# Altium schematic sheet CPU.schdoc
size Tabloid
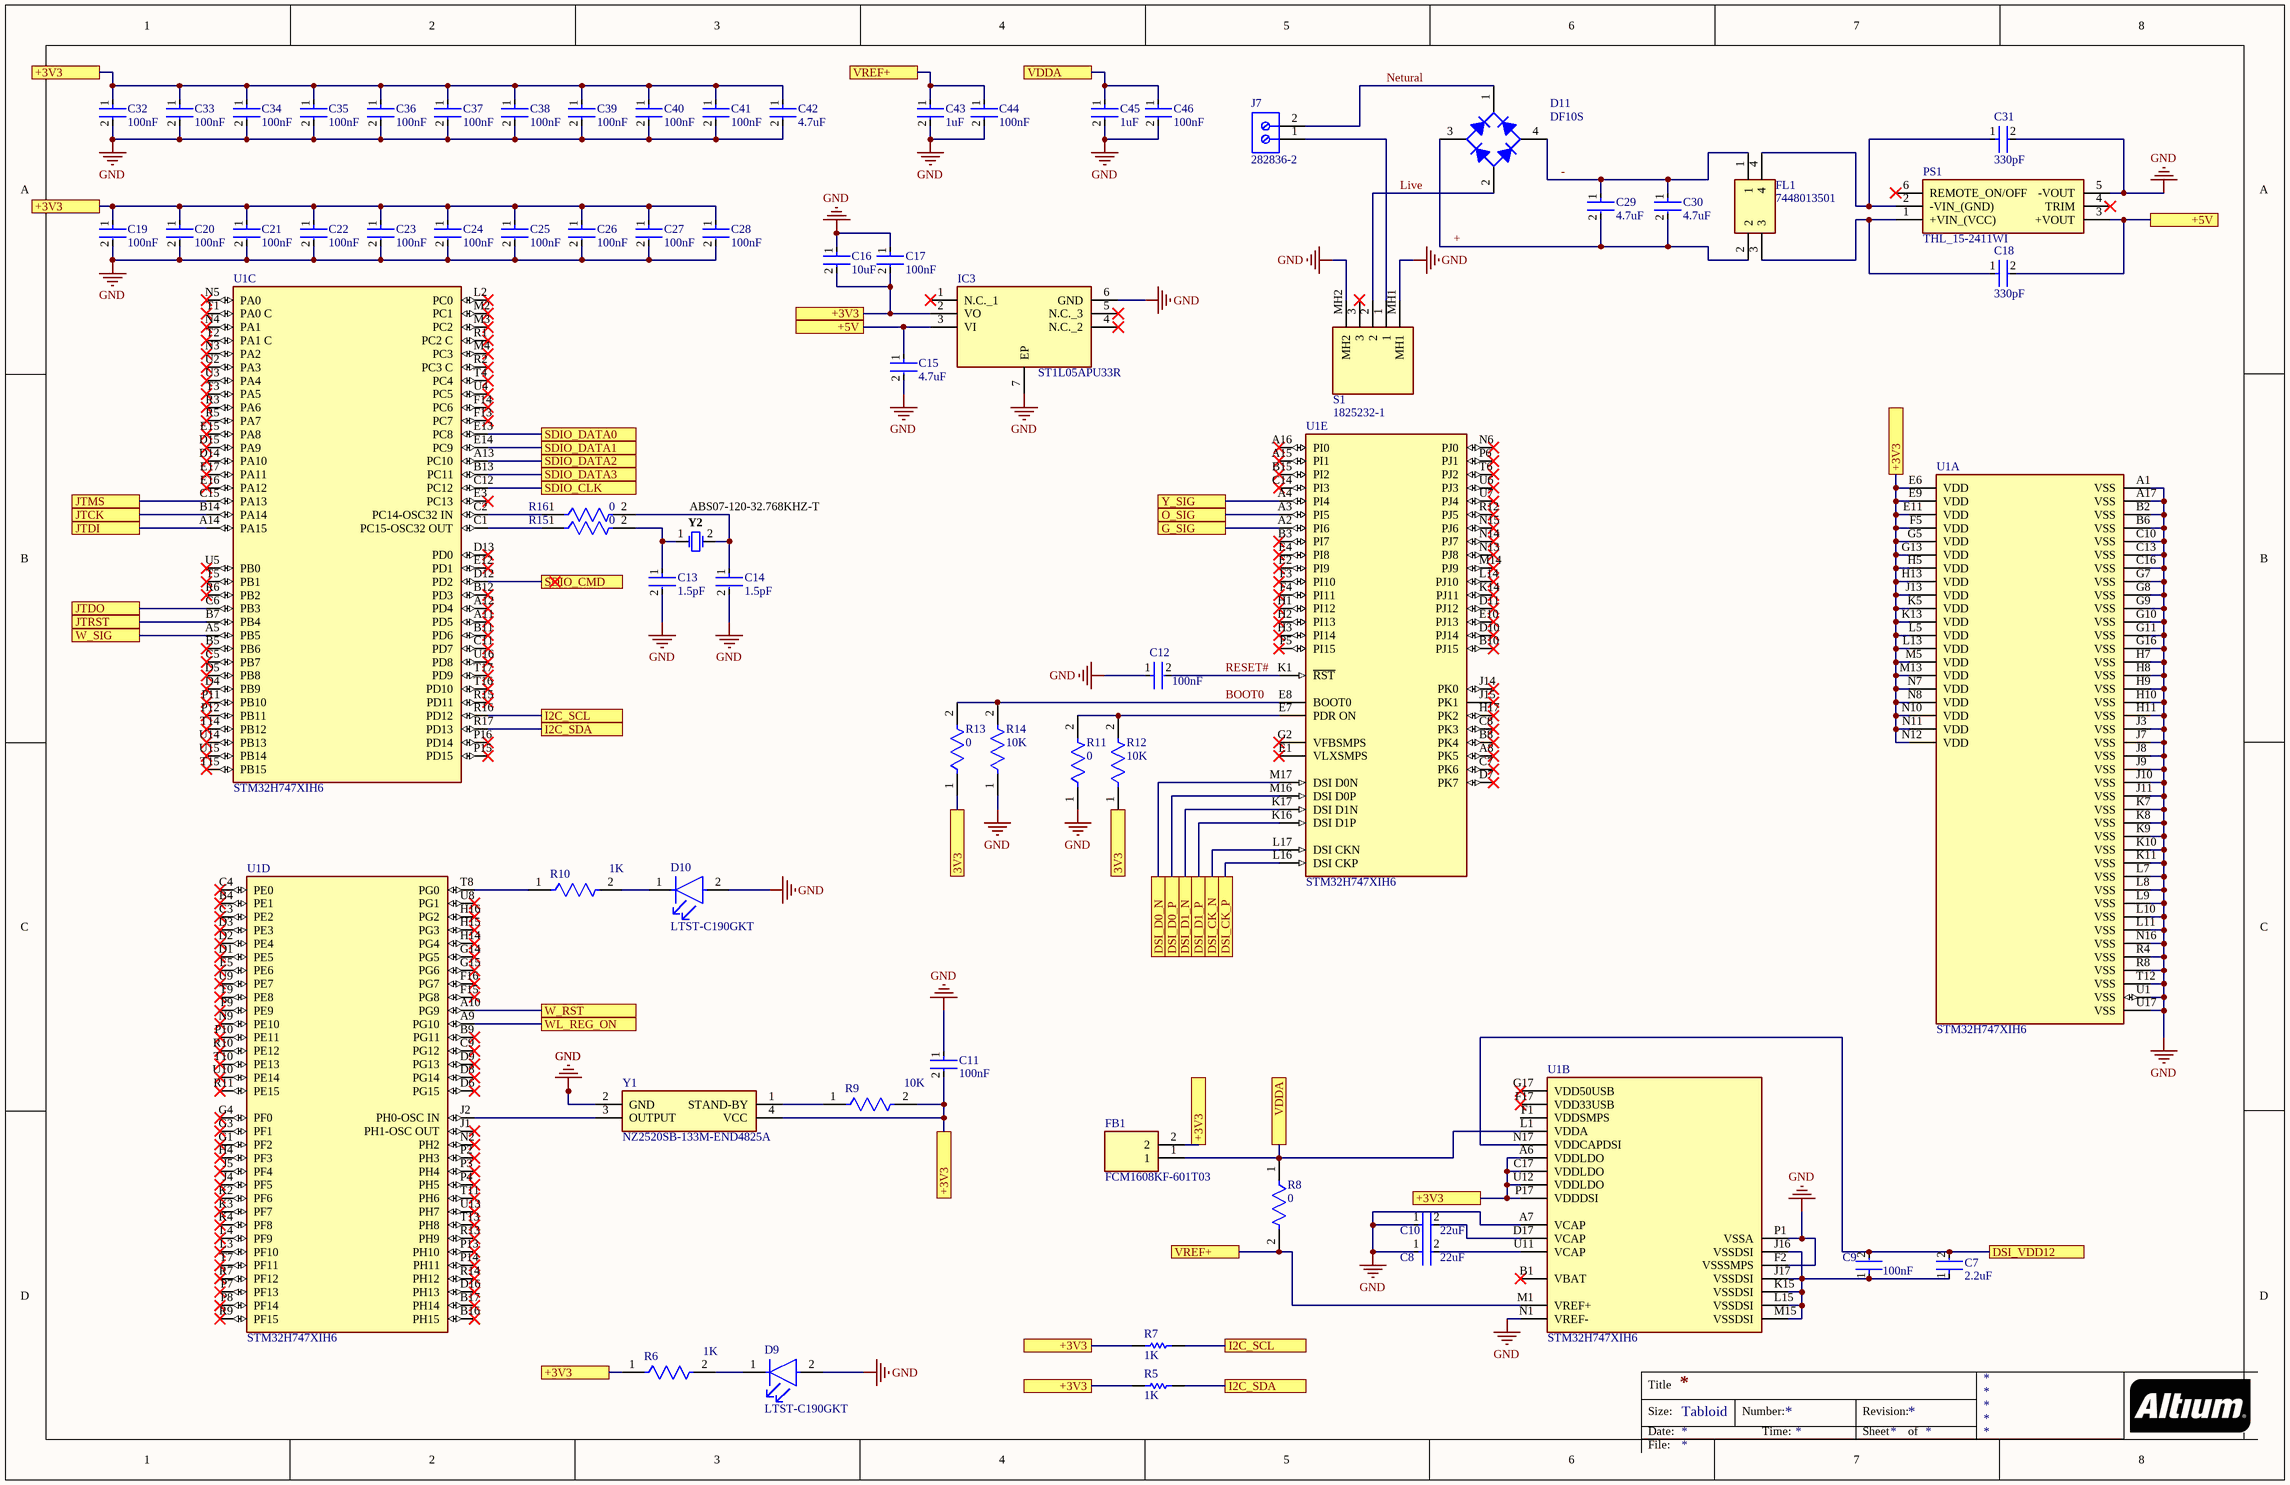
[diagram p0: CPU.schdoc]

## Parts
C7  2.2uF  [FP-GJM155-0_05-IPC_C]
C8  22uF  [FP-GJM155-0_05-IPC_C]
C9  100nF  [FP-GJM155-0_05-IPC_C]
C10  22uF  [FP-GJM155-0_05-IPC_C]
C11  100nF  [FP-GJM155-0_05-IPC_C]
C12  100nF  [FP-GJM155-0_05-IPC_C]
C13  1.5pF  [FP-GJM155-0_05-IPC_C]
C14  1.5pF  [FP-GJM155-0_05-IPC_C]
C15  4.7uF  [FP-GRM155-0_1-IPC_B]
C16  10uF  [FP-GRM188-0_1-e0_2_0_55-IPC_A]
C17  100nF  [FP-GRM033-0_03-MFG]
C18  330pF  [FP-GRM155-0_05-MFG]
C19  100nF  [FP-GRM033-0_03-MFG]
C20  100nF  [FP-GRM033-0_03-MFG]
C21  100nF  [FP-GRM033-0_03-MFG]
C22  100nF  [FP-GRM033-0_03-MFG]
C23  100nF  [FP-GRM033-0_03-MFG]
C24  100nF  [FP-GRM033-0_03-MFG]
C25  100nF  [FP-GRM033-0_03-MFG]
C26  100nF  [FP-GRM033-0_03-MFG]
C27  100nF  [FP-GRM033-0_03-MFG]
C28  100nF  [FP-GRM033-0_03-MFG]
C29  4.7uF  [FP-GRM155-0_1-IPC_B]
C30  4.7uF  [FP-GRM155-0_1-IPC_B]
C31  330pF  [FP-GRM155-0_05-MFG]
C32  100nF  [FP-GRM033-0_03-MFG]
C33  100nF  [FP-GRM033-0_03-MFG]
C34  100nF  [FP-GRM033-0_03-MFG]
C35  100nF  [FP-GRM033-0_03-MFG]
C36  100nF  [FP-GRM033-0_03-MFG]
C37  100nF  [FP-GRM033-0_03-MFG]
C38  100nF  [FP-GRM033-0_03-MFG]
C39  100nF  [FP-GRM033-0_03-MFG]
C40  100nF  [FP-GRM033-0_03-MFG]
C41  100nF  [FP-GRM033-0_03-MFG]
C42  4.7uF  [FP-GRM155-0_1-IPC_B]
C43  1uF  [FP-GRM15-0_1-MFG]
C44  100nF  [FP-GRM033-0_03-MFG]
C45  1uF  [FP-GRM15-0_1-MFG]
C46  100nF  [FP-GRM033-0_03-MFG]
D9  LTST-C190GKT  [FP-LTST-C190GKT-MFG]
D10  LTST-C190GKT  [FP-LTST-C190GKT-MFG]
D11  DF10S  [FAIR-SDIP-4_V]
FB1  FCM1608KF-601T03  [BEADC1608X95N]
FL1  7448013501  [7448013501]
IC3  ST1L05APU33R  [SON95P300X300X100-7N-D]
J7  282836-2  [TECO-282836-2_V]
PS1  THL_15-2411WI  [THL152411WI]
R5  1K  [RESC1608X55X30LL20T20]
R6  1K  [FP-CRCW0402-e3-MFG]
R7  1K  [RESC1608X55X30LL20T20]
R8  0  [FP-CRCW0402-e3-IPC_C]
R9  10K  [FP-CRCW0402-e3-MFG]
R10  1K  [FP-CRCW0402-e3-MFG]
R11  0  [FP-CRCW0402-e3-IPC_C]
R12  10K  [FP-CRCW0402-e3-IPC_C]
R13  0  [FP-CRCW0402-e3-IPC_C]
R14  10K  [FP-CRCW0402-e3-IPC_C]
R15  0  [FP-CRCW0402-e3-IPC_C]
R16  0  [FP-CRCW0402-e3-IPC_C]
S1  1825232-1  [18252321]
U1  STM32H747XIH6  [FP-TFBGA240+25-A07U-MFG]  (parts A,B,C,D,E of 5)
Y1  NZ2520SB-133M-END4825A  [NZ2520SD]
Y2  ABS07-120-32.768KHZ-T  [ABRA-ABS07_A_V]

## Ports
3V3, +3V3, +5V, DSI_CK_N, DSI_CK_P, DSI_D0_N, DSI_D0_P, DSI_D1_N, DSI_D1_P, DSI_VDD12, G_SIG, I2C_SCL, I2C_SDA, JTCK, JTDI, JTDO, JTMS, JTRST, O_SIG, SDIO_CLK, SDIO_CMD, SDIO_DATA0, SDIO_DATA1, SDIO_DATA2, SDIO_DATA3, VDDA, VREF+, W_RST, W_SIG, WL_REG_ON, Y_SIG

## Nets
GND: C8.1 C10.1 C11.1 C12.1 C13.2 C14.2 C15.2 C16.1 C17.1 C19.2 C20.2 C21.2 C22.2 C23.2 C24.2 C25.2 C26.2 C27.2 C28.2 C31.2 C32.2 C33.2 C34.2 C35.2 C36.2 C37.2 C38.2 C39.2 C40.2 C41.2 C42.2 C43.2 C44.2 C45.2 C46.2 D9.2(A) D10.2(A) IC3.6(GND) IC3.7(EP) PS1.5(-VOUT) R11.1 R14.1 S1.MH1 S1.MH2 U1.A1(VSS) U1.A7(VCAP) U1.A17(VSS) U1.B2(VSS) U1.B6(VSS) U1.C10(VSS) U1.C13(VSS) U1.C16(VSS) U1.F2(VSSSMPS) U1.G7(VSS) U1.G8(VSS) U1.G9(VSS) U1.G10(VSS) U1.G11(VSS) U1.G16(VSS) U1.H7(VSS) U1.H8(VSS) U1.H9(VSS) U1.H10(VSS) U1.H11(VSS) U1.J3(VSS) U1.J7(VSS) U1.J8(VSS) U1.J9(VSS) U1.J10(VSS) U1.J11(VSS) U1.K7(VSS) U1.K8(VSS) U1.K9(VSS) U1.K10(VSS) U1.K11(VSS) U1.L7(VSS) U1.L8(VSS) U1.L9(VSS) U1.L10(VSS) U1.L11(VSS) U1.N1(VREF-) U1.N16(VSS) U1.P1(VSSA) U1.R4(VSS) U1.R8(VSS) U1.T12(VSS) U1.U1(VSS) U1.U17(VSS) Y1.2(GND)
3V3: R12.1 R13.1 ; port 3V3
+: C29.2 C30.2 D11.3(C) FL1.2
+3V3: C11.2 C16.2 C17.2 C19.1 C20.1 C21.1 C22.1 C23.1 C24.1 C25.1 C26.1 C27.1 C28.1 C32.1 C33.1 C34.1 C35.1 C36.1 C37.1 C38.1 C39.1 C40.1 C41.1 C42.1 FB1.2 IC3.2(VO) R5.1 R6.1 R7.1 R9.2 U1.A6(VDDLDO) U1.C17(VDDLDO) U1.E6(VDD) U1.E9(VDD) U1.E11(VDD) U1.F5(VDD) U1.G5(VDD) U1.G13(VDD) U1.H5(VDD) U1.H13(VDD) U1.J13(VDD) U1.K5(VDD) U1.K13(VDD) U1.L5(VDD) U1.L13(VDD) U1.M5(VDD) U1.M13(VDD) U1.N7(VDD) U1.N8(VDD) U1.N10(VDD) U1.N11(VDD) U1.N12(VDD) U1.P17(VDDDSI) U1.U12(VDDLDO) Y1.4(VCC) ; port +3V3
+5V: C15.1 C18.2 IC3.3(VI) PS1.3(+VOUT) ; port +5V
-: C29.1 C30.1 D11.4(C) FL1.1
BOOT0: R13.2 R14.2 U1.E8(BOOT0)
DSI_CK_N: U1.L17(DSI_CKN) ; port DSI_CK_N
DSI_CK_P: U1.L16(DSI_CKP) ; port DSI_CK_P
DSI_D0_N: U1.M17(DSI_D0N) ; port DSI_D0_N
DSI_D0_P: U1.M16(DSI_D0P) ; port DSI_D0_P
DSI_D1_N: U1.K17(DSI_D1N) ; port DSI_D1_N
DSI_D1_P: U1.K16(DSI_D1P) ; port DSI_D1_P
DSI_VDD12: C7.2 C9.2 U1.N17(VDDCAPDSI) ; port DSI_VDD12
G_SIG: U1.A2(PI6) ; port G_SIG
I2C_SCL: R7.2 U1.R16(PD12) ; port I2C_SCL
I2C_SDA: R5.2 U1.R17(PD13) ; port I2C_SDA
JTCK: U1.B14(PA14) ; port JTCK
JTDI: U1.A14(PA15) ; port JTDI
JTDO: U1.C6(PB3) ; port JTDO
JTMS: U1.C15(PA13) ; port JTMS
JTRST: U1.B7(PB4) ; port JTRST
Live: D11.2(A) S1.2
Netural: D11.1(K) J7.2
O_SIG: U1.A3(PI5) ; port O_SIG
RESET#: C12.2 U1.K1(~{RST})
SDIO_CLK: U1.C12(PC12) ; port SDIO_CLK
SDIO_CMD: U1.D12(PD2) ; port SDIO_CMD
SDIO_DATA0: U1.E13(PC8) ; port SDIO_DATA0
SDIO_DATA1: U1.E14(PC9) ; port SDIO_DATA1
SDIO_DATA2: U1.A13(PC10) ; port SDIO_DATA2
SDIO_DATA3: U1.B13(PC11) ; port SDIO_DATA3
VDDA: C45.1 C46.1 FB1.1 R8.1 U1.L1(VDDA) ; port VDDA
VREF+: C43.1 C44.1 R8.2 U1.M1(VREF+) ; port VREF+
W_RST: U1.A10(PG9) ; port W_RST
W_SIG: U1.A5(PB5) ; port W_SIG
WL_REG_ON: U1.A9(PG10) ; port WL_REG_ON
Y_SIG: U1.A4(PI4) ; port Y_SIG
NetC7_1: C7.1 C9.1 U1.J16(VSSDSI) U1.J17(VSSDSI) U1.K15(VSSDSI) U1.L15(VSSDSI) U1.M15(VSSDSI)
NetC8_2: C8.2 U1.U11(VCAP)
NetC10_2: C10.2 U1.D17(VCAP)
NetC13_1: C13.1 R15.2 Y2.1
NetC14_1: C14.1 R16.2 Y2.2
NetC18_1: C18.1 FL1.3 PS1.1(+VIN_(VCC))
NetC31_1: C31.1 FL1.4 PS1.2(-VIN_(GND))
NetD9_1: D9.1(C) R6.2
NetD10_1: D10.1(C) R10.2
NetJ7_1: J7.1 S1.1
NetR9_1: R9.1 Y1.1(STAND-BY)
NetR10_1: R10.1 U1.T8(PG0)
NetR11_2: R11.2 R12.2 U1.E7(PDR_ON)
NetR15_1: R15.1 U1.C1(PC15-OSC32_OUT)
NetR16_1: R16.1 U1.C2(PC14-OSC32_IN)
NetU1_J2: U1.J2(PH0-OSC_IN) Y1.3(OUTPUT)

Not connected (* = marked no-connect by the designer): IC3 1(N.C._1)* 4(N.C._2)* 5(N.C._3)*; PS1 4(TRIM)* 6(REMOTE_ON/OFF)*; S1 3*; U1 A8(PK5)* A11(PD5)* A12(PD4)* A15(PI1)* A16(PI0)* B1(VBAT)* B3(PI7)* B4(PE1)* B5(PB6)* B8(PK4)* B9(PG11)* B10(PJ15)* B11(PD6)* B12(PD3)* B15(PI2)* B16(PH15)* B17(PH14)* C3(PE2)* C4(PE0)* C5(PB7)* C7(PK6)* C8(PK3)* C9(PG12)* C11(PD7)* C14(PI3)* D1(PE5)* D2(PE4)* D3(PE3)* D4(PB9)* D5(PB8)* D6(PG15)* D7(PK7)* D8(PG14)* D9(PG13)* D10(PJ14)* D11(PJ12)* D13(PD0)* D14(PA10)* D15(PA9)* D16(PH13)* E1(VLXSMPS)* E2(PI9)* E3(PC13)* E4(PI8)* E5(PE6)* E10(PJ13)* E12(PD1)* E15(PA8)* E16(PA12)* E17(PA11)* F1(VDDSMPS) F3(PI10)* F4(PI11)* F13(PC7)* F14(PC6)* F15(PG8)* F16(PG7)* F17(VDD33USB)* G1(PF2)* G2(VFBSMPS)* G3(PF1)* G4(PF0)* G14(PG5)* G15(PG6)* G17(VDD50USB)* H1(PI12)* H2(PI13)* H3(PI14)* H4(PF3)* H14(PG4)* H15(PG3)* H16(PG2)* H17(PK2)* J1(PH1-OSC_OUT)* J4(PF5)* J5(PF4)* J14(PK0)* J15(PK1)* K2(PF6)* K3(PF7)* K4(PF8)* K14(PJ11)* L2(PC0)* L3(PF10)* L4(PF9)* L14(PJ10)* M2(PC1)* M3(PC2)* M4(PC3)* M14(PJ9)* N2(PH2)* N3(PA2)* N4(PA1)* N5(PA0)* N6(PJ0)* N9(PE10)* N13(PJ8)* N14(PJ7)* N15(PJ6)* P2(PH3)* P3(PH4)* P4(PH5)* P5(PI15)* P6(PJ1)* P7(PF13)* P8(PF14)* P9(PE9)* P10(PE11)* P11(PB10)* P12(PB11)* P13(PH10)* P14(PH11)* P15(PD15)* P16(PD14)* R1(PC2_C)* R2(PC3_C)* R3(PA6)* R5(PA7)* R6(PB2)* R7(PF12)* R9(PF15)* R10(PE12)* R11(PE15)* R12(PJ5)* R13(PH9)* R14(PH12)* R15(PD11)* T1(PA0_C)* T2(PA1_C)* T3(PA5)* T4(PC4)* T5(PB1)* T6(PJ2)* T7(PF11)* T9(PE8)* T10(PE13)* T11(PH6)* T13(PH8)* T14(PB12)* T15(PB15)* T16(PD10)* T17(PD9)* U2(PA3)* U3(PA4)* U4(PC5)* U5(PB0)* U6(PJ3)* U7(PJ4)* U8(PG1)* U9(PE7)* U10(PE14)* U13(PH7)* U14(PB13)* U15(PB14)* U16(PD8)*

## Notes on the sheet
- Title
- Size:
- Date:
- Tabloid
- Number:
- Time:
- Revision:
- Sheet
- of
- File:

## Library data of the parts
C7-C14 = CMP-2008-03820-2: Multi-Layer Ceramic Capacitor 1.5pF C0G  ±0.1pF 0402 Paper T/R; Temperature Coefficient: 30ppm/°C; Voltage Rating: 50V; Depth: 0.5mm; Case Code (Imperial): 0402; Package Quantity: 10000; Length: 1mm; Number of Pins: 2; Max Operating Temperature: 125°C; Mount: Surface Mount; Construction: Flat; Thickness: 0.022inch; Series: GJM; Packaging: Tape and Reel; Radiation Hardening: No; REACH SVHC: No SVHC; Case/Package: 0402; Lead Free: Lead Free; Voltage Rating (DC): 50V; Min Operating Temperature: -55°C; Dielectric: C0G; Termination: SMD/SMT; Width: 0.5mm; Capacitance: 1.5pF; Lead Pitch: 0.3mm; Case Code (Metric): 1005; Voltage: 50V; Height: 0.5mm
C15 C29 C30 C42 = CMP-2008-04549-2: Chip Multilayer Ceramic Capacitors for General Purpose, 0402, 4.7uF, X5R, 15%, 20%, 6.3V; Height: 0.5mm; Weight: 0.000212oz; Length: 1mm; Case Code (Metric): 1005; Packaging: Tape and Reel; Termination: SMD/SMT; Dielectric: X5R; Depth: 0.5mm; Case Code (Imperial): 0402; Min Operating Temperature: -55°C; Case/Package: 0402; Voltage: 6.3V; Width: 0.02inch; Capacitance: 4.7uF; Lead Free: Lead Free; Thickness: 0.022inch; Contact Plating: Tin; REACH SVHC: No SVHC; Package Quantity: 10000; Tolerance: 20%; Voltage Rating (DC): 6.3V; Voltage Rating: 6.3V; Mount: Surface Mount; Max Operating Temperature: 85°C
C16 = CMP-2006-02792-2: Chip Multilayer Ceramic Capacitors for General Purpose, 0603, 10uF, X5R, 15%, 20%, 6.3V; Packaging: Tape and Reel; Voltage Rating (DC): 6.3V; Width: 0.031inch; Termination: SMD/SMT; Dielectric: X5R; Package Quantity: 4000; Voltage Rating: 6.3V; Capacitance: 10uF; Case/Package: 0603; Min Operating Temperature: -55°C; Voltage: 6.3V; Length: 1.6mm; Thickness: 0.035inch; Lead Free: Lead Free; Depth: 0.8mm; Case Code (Imperial): 0603; Max Operating Temperature: 85°C; Material: Ceramic; Height: 0.8mm; Tolerance: 20%; Mount: Surface Mount; REACH SVHC: No SVHC; Radiation Hardening: No; Case Code (Metric): 1608
C17 C19-C28 C32-C41 C44 C46 = CMP-06035-000062-2: Chip Multilayer Ceramic Capacitors for General Purpose, 0201, 0.10uF, X5R, 15%, 10%, 6.3V; Min Operating Temperature: -55°C; Lead Free: Lead Free; Radiation Hardening: No; Dielectric: X5R; Voltage Rating (DC): 6.3V; REACH SVHC: No SVHC; Case/Package: 0201; Voltage Rating: 6.3V; Length: 0.6mm; Max Operating Temperature: 85°C; Width: 0.012inch; Depth: 0.3mm; Material: Ceramic; Case Code (Metric): 0603; Thickness: 0.013inch; Packaging: Tape and Reel; Height: 0.3mm; Capacitance: 100nF; Weight: 6E-06oz; Package Quantity: 1; Mount: Surface Mount; Voltage: 6.3V; Case Code (Imperial): 0201; Tolerance: 10%; Termination: SMD/SMT
C18 C31 = CMP-06035-004830-1: Chip Multilayer Ceramic Capacitors for General Purpose, 0402, 330pF, C0G, 30ppm/°C, 5%, 50V; Insulation Resistance: 10GR; REACH SVHC: No SVHC; Depth: 0.5mm; Voltage Rating (DC): 50V; Number of Pins: 2; Max Operating Temperature: 125°C; Dielectric: C0G; Tolerance: 5%; Package Quantity: 1; Length: 1mm; Thickness: 0.022inch; Case/Package: 0402; Lead Free: Lead Free; Case Code (Imperial): 0402; Material: Ceramic; Voltage Rating: 50V; Voltage: 50V; Radiation Hardening: No; Min Operating Temperature: -55°C; Packaging: Tape and Reel; Capacitance: 330pF; Case Code (Metric): 1005; Width: 0.5mm; Mount: Surface Mount; Height: 0.5mm; Temperature Coefficient: 30ppm/°C; Termination: SMD/SMT
C43 C45 = CMP-2008-04556-2: CAP CER 1UF 10V X5R 0402; Manufacturer Part Number: GRM155R61A105KE15D; Manufacturer: Murata; Material: Ceramic; Tolerance: 10%; Temperature Coefficient: 15%; Octopart: https://octopart.com/grm155r61a105ke15d-murata-197442; Lead Free: Yes; ComponentLink2Description: Datasheet; Temperature: -55°C to +85°C; Temperature Range High: +85°C; Height: 0.55mm; Capacitance: 1uF; Ipc Land Pattern Name: CAPC10050X50; ComponentLink2URL: https://search.murata.co.jp/Ceramy/image/img/A01X/G101/ENG/GRM155R61A105KE15-01A.pdf; Temperature Range Low: -55°C; Device Class L2: Capacitors; Voltage Rating: 10V; RoHS: TRUE; Device Class L1: Passive Components; Device Class L3: Ceramic Capacitors; Temperature Characteristic: X5R; Mouser Description: 0402 1 uF 10 V ±10% Tolerance X5R Surface Mount Multilayer Ceramic Capacitor; Automotive: No; Package: GRM15-0.1; Digikey Description: CAP CER 1UF 10V X5R 0402; Value: 1uF; Category: Cap
D9 D10 = CMP-22017-000005-2: LED GREEN CLEAR CHIP SMD; Dominant Wavelength: 569nm; Reverse Voltage: 5V; Lens Color: Colorless; Viewing Angle: 130°; Voltage: 2V; Forward Current: 30mA; Power Dissipation: 100mW; Luminous Intensity: 6mcd; Number of LEDs: 1; Forward Voltage: 2.1V; Wavelength: 565nm; Test Current: 10mA; Min Operating Temperature: -55°C; Lens Style: Clear; Mount: Surface Mount; Width: 0.8mm; Packaging: Tape and Reel; Lens Transparency: Clear; Case Code (Metric): 1608; Depth: 0.8mm; Case Code (Imperial): 0603; Case/Package: 0603; Number of Pins: 2; Max Operating Temperature: 85°C; Lead Free: Lead Free; Number of Elements: 1; Length: 1.6mm; Height: 0.8mm; Package Quantity: 1; Power Rating: 100mW; Radiation Hardening: No; Illumination Color: Green; Color: Green
D11 = CMP-2000-06153-1: Bridge Rectifier, 1.5 A, 1000 V, 4-Pin SDIP, RoHS, Tape and Reel; Manufacturer: FairchildSemiconductor; Configuration: Single; Peak Average Forward Current: 1.5@Ta=40CA; Peak Reverse Repetitive Voltage: 1000V; Peak Reverse Current: 5uA; Bridge Type: SinglePhase; Peak Forward Voltage: 1.1@1AV; Datasheet Version: Rev. 1.5, 05/2015; Package: 4SDIPSMD; Operating Temperature: -55to150°C; Package Reference: SDIP 4L; Datasheet URL: http://www.farnell.com/datasheets/1941063.pdf; Packaging: Tape&Reel; Manufacturer URL: https://www.fairchildsemi.com/; Mounting Technology: SurfaceMount; Category: BridgeRectifier; Package Description: 4-Pin Surface Mount Device, Body 8.28 x 6.35 mm, Pitch 5.1 mm; Mounting: SurfaceMount
FB1 = FCM1608KF-601T03: Ferrite Bead; Manufacturer_Name: TAI-TECH; Datasheet Link: https://www.tai-tech.com.tw/_upload/files/FCM1608-Series.pdf; Height: 0.95mm; Manufacturer_Part_Number: FCM1608KF-601T03
FL1 = 7448013501: Filter; Manufacturer_Name: Wurth Elektronik; Datasheet Link: https://componentsearchengine.com/Datasheets/1/7448013501.pdf; Height: 16mm; Manufacturer_Part_Number: 7448013501; Mouser Part Number: 710-7448013501; Mouser Price/Stock: https://www.mouser.com/Search/Refine.aspx?Keyword=710-7448013501
IC3 = ST1L05APU33R: Integrated Circuit; Manufacturer_Name: STMicroelectronics; Datasheet Link: https://www.st.com/resource/en/datasheet/st1l05.pdf; Height: 1mm; Manufacturer_Part_Number: ST1L05APU33R; Mouser Part Number: 511-ST1L05APU33R; Mouser Price/Stock: https://www.mouser.co.uk/ProductDetail/STMicroelectronics/ST1L05APU33R?qs=TEE7KwcILpzoVyxOB2gDPw%3D%3D; Arrow Part Number: ST1L05APU33R; Arrow Price/Stock: https://www.arrow.com/en/products/st1l05apu33r/stmicroelectronics
J7 = CMP-1684-00017-1: Female Header, Pitch 5 mm, 1 x 2 Position, Height 10 mm, Tail Length 3.5 mm, Rohs, Bulk; Manufacturer: TE Connectivity; Wire Gauge: 16-30AWG; Product Training Modules: Wire-to-BoardEurostyleTerminalBlocks; Clamp Material - Plating: Brass-NickelPlated; Voltage: 300V; Mating Orientation: HorizontalwithBoard; Current: 13.5A; Pitch: 0.197"(5.00mm); Screw Thread: M3; 3D Model: 282836-2.pdf; Other Names: 5ULV-02B / A98076; Dynamic Catalog: BuchananSeries; Number of Levels: 1; Torque - Screw: 0.68Nm(6Lb-In); Featured Product: EurostyleTerminalBlockConnectors; Positions Per Level: 2; Wire Termination: Screw-RisingCageClamp; Datasheet URL: http://www.te.com.cn/commerce/DocumentDelivery/DDEController?Action=showdoc&DocId=Catalog+Section%7F1308389_EUROSTYLE_TERMINAL_BLOCKS%7F0607%7Fpdf%7FEnglish%7FENG_CS_1308389_EUROSTYLE_TERMINAL_BLOCKS_0607.pdf%7F282836-2; Color: Green; Family: TerminalBlocks-WiretoBoard; RoHS Information: 282836-2StatementofCompliance; Standard Package: 300; Contact Material - Plating: Brass-TinPlated; Manufacturer URL: http://www.te.com; Housing Material: Polyamide(PA66),Nylon6/6; Features: Interlocking(Side); Package Description: Female Header, Pitch 5 mm, 1 x 2 Position, Height 10 mm, Tail Length 3.5 mm; Mounting Type: ThroughHole; Package Reference: THD; Packaging: Bulk; Series: Buchanan; Category: Connectors,Interconnects; Screw Material - Plating: Brass-NickelPlated
PS1 = THL_15-2411WI: Power Supply; Manufacturer_Name: Traco Power; Manufacturer_Part_Number: THL 15-2411WI; Datasheet Link: https://componentsearchengine.com/Datasheets/1/THL 15-2411WI.pdf; Height: 10.66mm; Mouser Part Number: 495-THL15-2411WI; Mouser Price/Stock: https://www.mouser.co.uk/ProductDetail/TRACO-Power/THL-15-2411WI/?qs=vLWxofP3U2zTxW0y6%2FAPOg%3D%3D
R5 R7 = CMP-2000-00873-1: Manufacturer: Panasonic; Part Number: ERA3AEB102V
R6 R9 R10 = CMP-2002-08276-2: RES Thick Film, 1kΩ, 1%, 0.063W, 100ppm/°C, 0402; Resistance: 1kR; Power Rating: 63mW; Voltage Rating (DC): 50V; Package Quantity: 10; Termination: SMD/SMT; Width: 0.5mm; Military Standard: Not; Length: 1mm; Contact Plating: Tin; Mount: Surface Mount; Packaging: Tape and Reel; Case Code (Imperial): 0402; Tolerance: 1%; Weight: 2.3E-05oz; Number of Pins: 2; Case/Package: 0402; Case Code (Metric): 1005; Lead Free: Lead Free; Number of Terminations: 2; Max Power Dissipation: 63mW; Depth: 0.5mm; Temperature Coefficient: 100ppm/°C; Max Operating Temperature: 155°C; Height: 0.35mm; Features: Automotive AEC-Q200; Composition: Thick Film; Radiation Hardening: No; Voltage Rating: 50V; Min Operating Temperature: -55°C
R8 R11-R16 = CMP-2002-08122-2: RES Thick Film, 0Ω, 0.063W, 0402; Tolerance: 5%; Max Power Dissipation: 63mW; Voltage Rating: 50V; Temperature Coefficient: 100ppm/°C; Resistance: 0mR; Contact Plating: Tin; Height: 0.35mm; Radiation Hardening: No; Features: Automotive AEC-Q200; Composition: Thick Film; Width: 0.5mm; Weight: 2.3E-05oz; Termination: SMD/SMT; Packaging: Tape and Reel; Mount: Surface Mount; Case Code (Metric): 1005; Military Standard: Not; Min Operating Temperature: -55°C; Number of Terminations: 2; Package Quantity: 1; Case Code (Imperial): 0402; Depth: 0.5mm; Max Operating Temperature: 155°C; Case/Package: 0402; Power Rating: 63mW; Lead Free: Lead Free; Voltage Rating (DC): 50V; Length: 1mm
S1 = 1825232-1: Switch; Manufacturer_Name: TE Connectivity; Datasheet Link: https://componentsearchengine.com/Datasheets/1/1825232-1.pdf; Height: 3.7mm; Manufacturer_Part_Number: 1825232-1; Mouser Part Number: 655-1825232-1; Mouser Price/Stock: https://www.mouser.co.uk/ProductDetail/TE-Connectivity-PB/1825232-1?qs=kTKVN3NWb5FosGxaNC1%252BtA%3D%3D; Arrow Part Number: 1825232-1; Arrow Price/Stock: https://www.arrow.com/en/products/1825232-1/te-connectivity
U1 = CMP-12105-000055-1: HIGH-PERFORMANCE AND DSP WITH DP; Manufacturer: STMicroelectronics; Number Of Uart Channels: 9; Number Of Pwm Channels: 2; Memory Size: 2MBytes; Number Of Ethernet Channels: 1; Ram Size: 1MBytes; Number Of Timers/Counters: 22; Data Bus Width: 32bits; Core Architecture: ARM Cortex-M4, ARM Cortex-M7; Interface: I2C,SPI,UART,USART,CAN,USB,LIN,IrDA,Ethernet,I2S,SMBus,Other; Number Of Adc Channels: 36; Min Supply Voltage: 1.2V; Number Of A/D Converters: 3; Number Of Spi Channels: 6; Max Supply Voltage: 3.6V; Frequency: 480MHz; Memory Type: FLASH; Number Of I2C Channels: 4; Max Junction Temp: +125°C; Standoff Height: 0.15mm; Number Of I/Os: 168; Device Class L2: Embedded Processors and Controllers; Digikey Description: HIGH-PERFORMANCE AND DSP WITH DP; RoHS: TRUE; Lead Free: Yes; Manufacturer Part Number: STM32H747XIH6; ComponentLink2URL: https://www.st.com/resource/en/datasheet/stm32h747xi.pdf; Mouser Description: STM32 Series 2 MB Flash 1 MB RAM 480 MHz 32-Bit Microcontroller - TFBGA-265; Device Class L1: Integrated Circuits (ICs); Ipc Land Pattern Name: BGA289N80P17X17_1400X1400X110; Category: IC; Device Class L3: Microcontrollers; Ambient Temperature Range High: +85°C; Number Of Cores: 2; Temperature Range High: +125°C; ComponentLink2Description: Datasheet; Automotive: No; Ambient Temperature Range Low: -40°C; Package: TFBGA240+25-A07U; Temperature: -40°C to +125°C; Number Of Usb Channels: 2; Temperature Range Low: -40°C; Height: 1.1mm; Octopart: https://octopart.com/stm32h747xih6-stmicroelectronics-100293943
Y1 = NZ2520SB-133M-END4825A: Crystal or Oscillator; Manufacturer_Name: NDK; Datasheet Link: https://media.digikey.com/pdf/Data%20Sheets/NDK%20PDFs/NZ2520SB-133M-END4825A.pdf; Manufacturer_Part_Number: NZ2520SB-133M-END4825A; Mouser Part Number: 344-NZ2520SB1334825A; Mouser Price/Stock: https://www.mouser.co.uk/ProductDetail/NDK/NZ2520SB-133M-END4825A?qs=w%2Fv1CP2dgqoOMP%2FVt8jH%252BA%3D%3D
Y2 = CMP-2000-07587-1: Tuning Fork Crystal, 32.768 KHz, +/- 20 ppm, -40 to 85 degC, 2-Pin SMD, RoHS, Tape and Reel; Manufacturer: Abracon; Case\/Package: SMD/SMT; Series Resistance: 60KOhm; Frequency Tolerance: 20ppm; Load Capacitance: 6pF; ESR (Equivalent Series Resistance): 55KOhm; Max Operating Temperature: 85degC; Width: 0.061inch; Radiation Hardening: No; Lead Free: LeadFree; RoHSCompliant: True; Depth: 1.5mm; Datasheet URL: http://www.abracon.com/Resonators/ABS07-120-32.768kHz-T.pdf; Frequency: 32.768KHz; Termination: SMD/SMT; Manufacturer URL: http://www.abracon.com/; Package Quantity: 3000; Packaging: TapeandReel; Number of Pins: 2; Height: 0.035inch; Package Description: 2-Pin Surface Mount Device, Body 3.2 x 1.5 mm; Package Reference: ABS07; Mount: SurfaceMount; Tolerance: 20ppm; Mounting Technology: SurfaceMount; REACH SVHC: NoSVHC; Datasheet Version: 11/2014; Length: 3.2mm; Min Operating Temperature: -40degC